# Altium schematic sheet OZ440-SE100-CAR003_sheet10.SchDoc
size A3
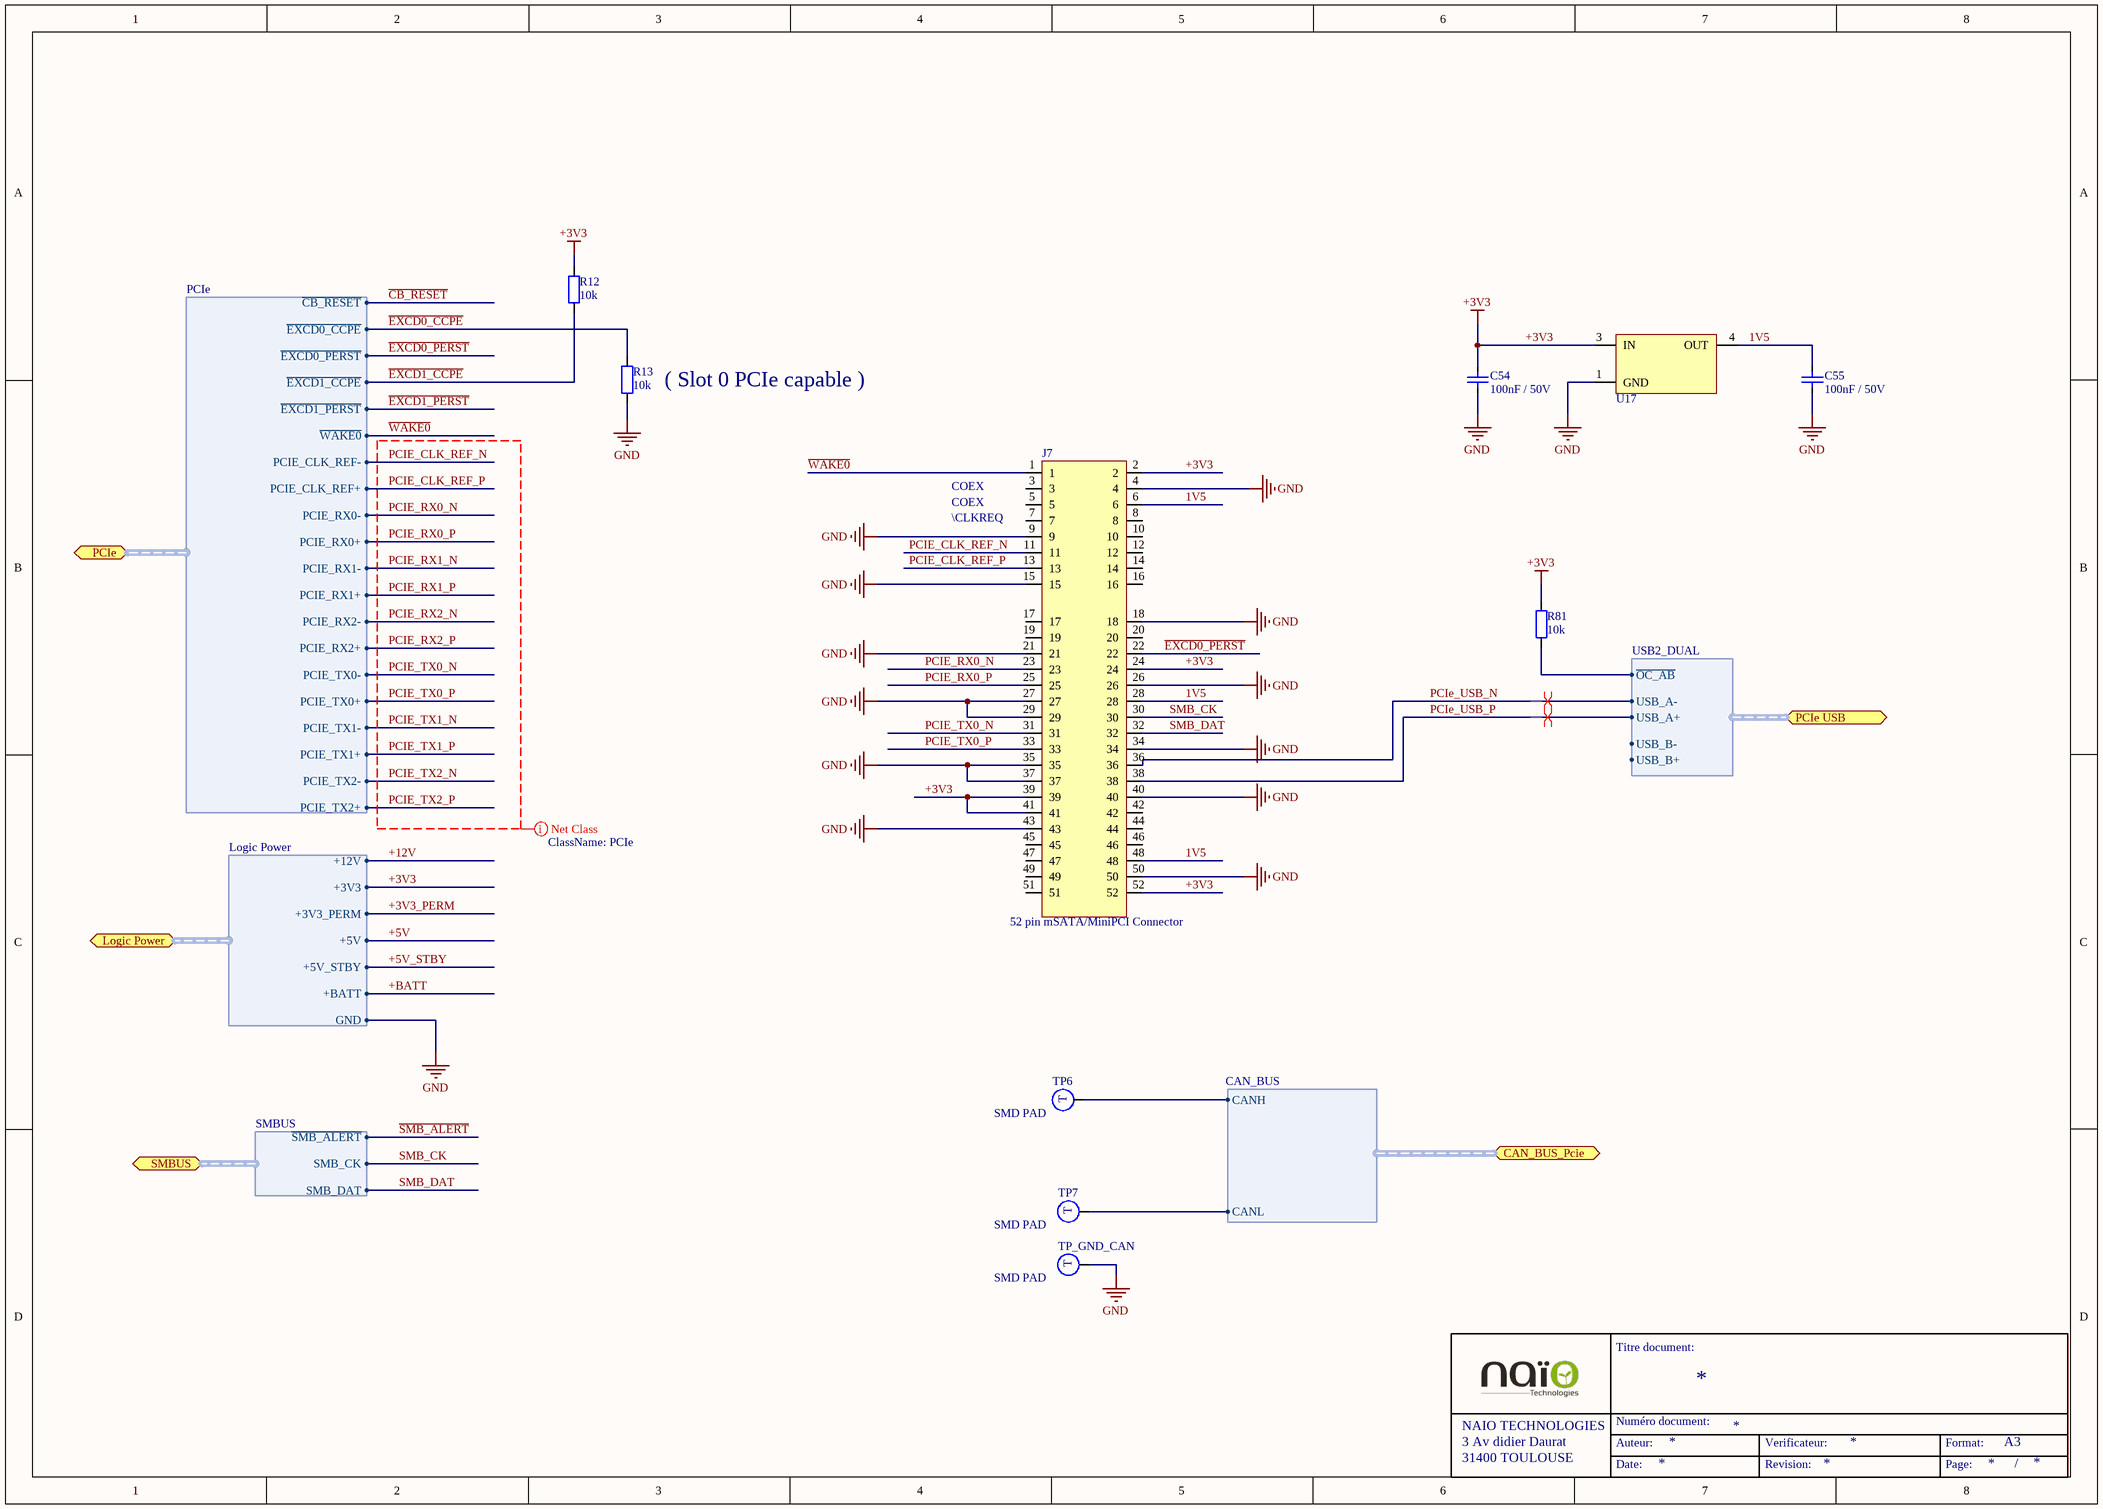
[diagram p0: OZ440-SE100-CAR003_sheet10.SchDoc]

## Parts
C54  Displayed reference: 100nF / 50V  [C0805-STD]  (hidden comment: CAP-SMD)
C55  Displayed reference: 100nF / 50V  [C0805-STD]  (hidden comment: CAP-SMD)
J7  Displayed reference: 52 pin mSATA/MiniPCI Connector  [CONN-SPE_MiniPCI-mSATA_MOLEX_67910-0002]  (hidden comment: CONN-STD-miniPCI_msata)
R12  Displayed reference: 10k  [R0805-STD]  (hidden comment: RES-SMD)
R13  Displayed reference: 10k  [R0805-STD]  (hidden comment: RES-SMD)
R81  Displayed reference: 10k  [R0805-STD]  (hidden comment: RES-SMD)
TP6  Displayed reference: SMD PAD  [MEC-STD-SMD_PAD_2mm]  (hidden comment: TP-STD-TEST_POINT)  (no BOM)
TP7  Displayed reference: SMD PAD  [MEC-STD-SMD_PAD_2mm]  (hidden comment: TP-STD-TEST_POINT)  (no BOM)
TP_GND_CAN  Displayed reference: SMD PAD  [MEC-STD-SMD_PAD_2mm]  (hidden comment: TP-STD-TEST_POINT)  (no BOM)
U17  NCP1117-DPAK  [DPAK-STD]  (value not drawn)

## Ports
CAN_BUS_Pcie (harness CAN_BUS), Logic Power (harness Logic Power), PCIe (harness PCIe), PCIe USB (harness USB2_DUAL), SMBUS (harness SMBUS)

## Harnesses
PCIe: ~{CB_RESET}, ~{EXCD0_CCPE}, ~{EXCD0_PERST}, ~{EXCD1_CCPE}, ~{EXCD1_PERST}, ~{WAKE0}, PCIE_CLK_REF-, PCIE_CLK_REF+, PCIE_RX0-, PCIE_RX0+, PCIE_RX1-, PCIE_RX1+, PCIE_RX2-, PCIE_RX2+, PCIE_TX0-, PCIE_TX0+, PCIE_TX1-, PCIE_TX1+, PCIE_TX2-, PCIE_TX2+
Logic Power: +12V, +3V3, +3V3_PERM, +5V, +5V_STBY, +BATT, GND
SMBUS: ~{SMB_ALERT}, SMB_CK, SMB_DAT
USB2_DUAL: ~{OC_AB}, USB_A-, USB_A+, USB_B-, USB_B+
CAN_BUS: CANH, CANL

## Nets
+3V3: C54.2 J7.2 J7.24 J7.39 J7.41 J7.52 R12.1 R81.1 U17.3(IN) ; port Logic Power.+3V3
GND: C54.1 C55.1 J7.4 J7.9 J7.15 J7.18 J7.21 J7.26 J7.27 J7.29 J7.34 J7.35 J7.37 J7.40 J7.43 J7.50 R13.2 TP_GND_CAN.1(T) U17.1(GND) ; port Logic Power.GND
1V5: C55.2 J7.6 J7.28 J7.48 U17.4(OUT)
+3V3_PERM: port Logic Power.+3V3_PERM
+5V: port Logic Power.+5V
+5V_STBY: port Logic Power.+5V_STBY
+12V: port Logic Power.+12V
+BATT: port Logic Power.+BATT
~{CB_RESET}: port PCIe.~{CB_RESET}
~{EXCD0_CCPE}: R13.1 ; port PCIe.~{EXCD0_CCPE}
~{EXCD0_PERST}: J7.22 ; port PCIe.~{EXCD0_PERST}
~{EXCD1_CCPE}: R12.2 ; port PCIe.~{EXCD1_CCPE}
~{EXCD1_PERST}: port PCIe.~{EXCD1_PERST}
~{SMB_ALERT}: port SMBUS.~{SMB_ALERT}
~{WAKE0}: J7.1 ; port PCIe.~{WAKE0}
PCIE_CLK_REF_N: J7.11 ; port PCIe.PCIE_CLK_REF-
PCIE_CLK_REF_P: J7.13 ; port PCIe.PCIE_CLK_REF+
PCIE_RX0_N: J7.23 ; port PCIe.PCIE_RX0-
PCIE_RX0_P: J7.25 ; port PCIe.PCIE_RX0+
PCIE_RX1_N: port PCIe.PCIE_RX1-
PCIE_RX1_P: port PCIe.PCIE_RX1+
PCIE_RX2_N: port PCIe.PCIE_RX2-
PCIE_RX2_P: port PCIe.PCIE_RX2+
PCIE_TX0_N: J7.31 ; port PCIe.PCIE_TX0-
PCIE_TX0_P: J7.33 ; port PCIe.PCIE_TX0+
PCIE_TX1_N: port PCIe.PCIE_TX1-
PCIE_TX1_P: port PCIe.PCIE_TX1+
PCIE_TX2_N: port PCIe.PCIE_TX2-
PCIE_TX2_P: port PCIe.PCIE_TX2+
PCIe_USB_N: J7.36 ; port PCIe USB.USB_A-
PCIe_USB_P: J7.38 ; port PCIe USB.USB_A+
SMB_CK: J7.30 ; port SMBUS.SMB_CK
SMB_DAT: J7.32 ; port SMBUS.SMB_DAT
NetR81_2: R81.2 ; port PCIe USB.~{OC_AB}
NetTP6_1: TP6.1(T) ; port CAN_BUS_Pcie.CANH
NetTP7_1: TP7.1(T) ; port CAN_BUS_Pcie.CANL

Not connected (* = marked no-connect by the designer): J7 3 5 7 8 10 12 14 16 17 19 20 42 44 45 46 47 49 51

## Layout directives
net class PCIe: PCIE_CLK_REF_N, PCIE_CLK_REF_P, PCIE_RX0_N, PCIE_RX0_P, PCIE_RX1_N, PCIE_RX1_P, PCIE_RX2_N, PCIE_RX2_P, PCIE_TX0_N, PCIE_TX0_P, PCIE_TX1_N, PCIE_TX1_P, PCIE_TX2_N, PCIE_TX2_P
differential pair: PCIe_USB_N, PCIe_USB_P

## Notes on the sheet
- (near R13) ( Slot 0 PCIe capable )
- COEX
- (near J7) \CLKREQ
- Titre document:
- NAIO TECHNOLOGIES
- 3 Av didier Daurat
- 31400 TOULOUSE
- Auteur:
- Numéro document:
- Verificateur:
- Format:
- A3
- Date:
- Revision:
- Page:
- /

## Library data of the parts
C54 C55 = VJ0805Y104KXAxx: 0805 100nF / 50V  X7R ceramic capacitor; Manufacturer: vishay; Max Voltage: 50; Tolerance: +/- 10%; Validated: N; Reference: VJ0805Y104KXAxx; Value: 100nF; Material: X7R; Footprint description: standard Capacitor 0805; Pin Count: 2; helpURL: http://www.vishay.com/docs/45200/highrels.pdf; Supplier 1: Farnell; Supplier Part Number 1: 1612208; Supplier 2: Digi-Key; Supplier Part Number 2: 720-1266-6-ND
J7 = 67910-0002: miniPCI / mSATA connector; Manufacturer: MOLEX; Validated: False; Reference: 67910-0002; Footprint description: 52 pin SMD, 0.8mm pitch; Pin Count: 52; Rev: C; helpURL: http://www.farnell.com/datasheets/70912.pdf; Supplier 1: Farnell; Supplier Part Number 1: 1394481; Supplier 2: Mouser; Supplier Part Number 2: 538-67910-0002
R12 R13 R81 = CRCW080510K0FKxx: 10k Ohm 0805 SMD resistor; Manufacturer: Vishay; Value: 10 000; Tolerance: 1 %; Rated Power: 0,125 W; Validated: No; Reference: CRCW080510K0FKxx; Footprint description: standard 0805 SMD; Pin Count: 2; helpURL: http://www.vishay.com/docs/20035/dcrcwe3.pdf; Supplier 1: Farnell; Supplier Part Number 1: 1469856; Supplier 2: Mouser; Supplier Part Number 2: 71-CRCW0805-10K-E3
TP6 TP7 TP_GND_CAN = SMD Pad: SMD Pad for wire soldering; Validated: False; Reference: SMD Pad; Footprint description: Smd pad; Pin Count: 1
U17 = NCP1117DT15RKG: 1.0 A Low-Dropout Positive Voltage Regulators; Manufacturer: On semi; Displayed reference: NCP1117-1.5V; Max Voltage: 20V; Max Current: 1A; Reference: NCP1117DT15RKG; Footprint description: DPAK; Pin Count: 3; Rev: 27; helpURL: http://www.onsemi.com/pub_link/Collateral/NCP1117-D.PDF; Supplier 1: Mouser; Supplier Part Number 1: 863-NCP1117DT15RKG; Supplier 2: Farnell; Supplier Part Number 2: 1221453